# EAGLE design SwitchedPowerAdapter (EAGLE 9.2.1)
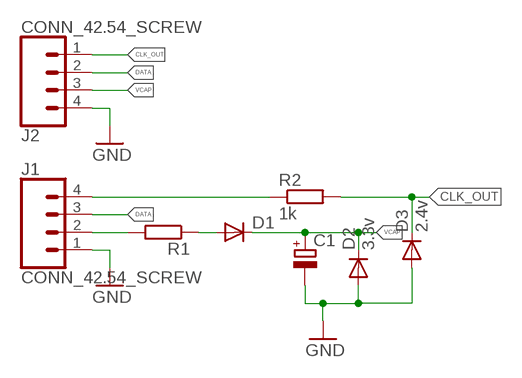
[diagram p0: schematic, sheet 1]

## Parts
C1  CPOL-EUHL  [HL]
D1  DIODEDO-214AC  [DO214AC]
D2  3.3v  DIODESOD-123  [SOD-123]
D3  2.4v  DIODESOD-123  [SOD-123]
J1  CONN_42.54_SCREW  [1X04_SCREW]
J2  CONN_42.54_SCREW  [1X04_SCREW]
R1  R-EU_R2512  [R2512]
R2  1k  R-EU_R0402  [R0402]

## Nets
CLK: J1.4 R2.1
CLK_OUT: D3.CAT(C) J2.1 R2.2
DATA: J1.3 J2.2
GND: C1.- D2.ANODE(A) D3.ANODE(A) J1.1 J2.4
N$1: J1.2 R1.2
N$2: D1.A R1.1
VCAP: C1.+ D1.C D2.CAT(C) J2.3

## Library data of the parts
C1 = bschulz_passives:CPOL-EU: POLARIZED CAPACITOR, European symbol
D1 = bschulz:DIODE: Genaric Diode; DIGIKEY: S1AFSCT-ND; MF: On Semiconductor; MPN: S1A
D2 = bschulz:DIODE: Genaric Diode; DIGIKEY: MMSZ4683-HE3-08GICT-ND; MF: Vishay; MPN: MMSZ4683-HE3-08
D3 = bschulz:DIODE: Genaric Diode
J1 J2 = bschulz:CONN_4: Genaric 4 pin connector; DIGIKEY: ED10563-ND; MF: On Shore; MPN: OSTVN04A150
R1 = bschulz_passives:R-EU_: RESISTOR, European symbol Digikey Parts: Yageo, 0402 <https://www.digikey.com/products/en/resistors/chip-resistor-surface-mount/52?k=&pkeyword=&sf=0&FV=ffec1104%2Cfffc000d%2C1c0002%2C440067%2C1f140000%2Cffe00034%2C400004&quantity=&ColumnSort=0&page=1&stock=1&pageSize=25> Yageo, 0603 <https://www.digikey.com/products/en/resistors/chip-resistor-surface-mount/52?k=&pkeyword=&s=4356&s=47360&sf=0&FV=fffc000d%2C1c0002%2C142c040c%2C1f140000%2Cffe00034&quantity=10&ColumnSort=1000011&page=1&stock=1&pageSize=25> Panasonic, 0603 <https://www.digikey.com/products/en/resistors/chip-resistor-surface-mount/52?k=&pkeyword=&pv252=68&sf=0&FV=ffec373d%2C1c0002%2C142c040c%2C1f140000%2Cffe00034%2C80002%2Cc0001&quantity=&ColumnSort=0&page=1&stock=1&pageSize=25> Panasonic, precision, 0603 <https://www.digikey.com/products/en/resistors/chip-resistor-surface-mount/52?FV=ffec4907%2Cfffc000a%2Cc0172%2C142c040c%2C1f140000%2Cffe00034%2C1c0002&quantity=100&ColumnSort=2085&page=1&stock=1&pageSize=25> Panasonic, 0805 <https://www.digikey.com/products/en/resistors/chip-resistor-surface-mount/52?k=&pkeyword=&pv3=1&sf=0&FV=ffec373d%2C1c0002%2C1f140000%2Cffe00034%2C142c040d&quantity=&ColumnSort=0&page=1&stock=1&pageSize=25> Rohm, current sense <https://www.digikey.com/products/en/resistors/chip-resistor-surface-mount/52?k=&pkeyword=&pv3=1&sf=0&FV=ffecb688%2C1f140000%2Cffe00034%2C1c0002&quantity=&ColumnSort=0&page=1&stock=1&pageSize=25> Vishay, pulse proof automotive <https://www.digikey.com/products/en/resistors/chip-resistor-surface-mount/52?k=&pkeyword=&pv7=2&sf=0&FV=ffec5d6b%2Cffe00034%2C1f140000&quantity=&ColumnSort=0&page=1&stock=1&pageSize=25>
R2 = bschulz_passives:R-EU_: RESISTOR, European symbol Digikey Parts: Yageo, 0402 <https://www.digikey.com/products/en/resistors/chip-resistor-surface-mount/52?k=&pkeyword=&sf=0&FV=ffec1104%2Cfffc000d%2C1c0002%2C440067%2C1f140000%2Cffe00034%2C400004&quantity=&ColumnSort=0&page=1&stock=1&pageSize=25> Yageo, 0603 <https://www.digikey.com/products/en/resistors/chip-resistor-surface-mount/52?k=&pkeyword=&s=4356&s=47360&sf=0&FV=fffc000d%2C1c0002%2C142c040c%2C1f140000%2Cffe00034&quantity=10&ColumnSort=1000011&page=1&stock=1&pageSize=25> Panasonic, 0603 <https://www.digikey.com/products/en/resistors/chip-resistor-surface-mount/52?k=&pkeyword=&pv252=68&sf=0&FV=ffec373d%2C1c0002%2C142c040c%2C1f140000%2Cffe00034%2C80002%2Cc0001&quantity=&ColumnSort=0&page=1&stock=1&pageSize=25> Panasonic, precision, 0603 <https://www.digikey.com/products/en/resistors/chip-resistor-surface-mount/52?FV=ffec4907%2Cfffc000a%2Cc0172%2C142c040c%2C1f140000%2Cffe00034%2C1c0002&quantity=100&ColumnSort=2085&page=1&stock=1&pageSize=25> Panasonic, 0805 <https://www.digikey.com/products/en/resistors/chip-resistor-surface-mount/52?k=&pkeyword=&pv3=1&sf=0&FV=ffec373d%2C1c0002%2C1f140000%2Cffe00034%2C142c040d&quantity=&ColumnSort=0&page=1&stock=1&pageSize=25> Rohm, current sense <https://www.digikey.com/products/en/resistors/chip-resistor-surface-mount/52?k=&pkeyword=&pv3=1&sf=0&FV=ffecb688%2C1f140000%2Cffe00034%2C1c0002&quantity=&ColumnSort=0&page=1&stock=1&pageSize=25> Vishay, pulse proof automotive <https://www.digikey.com/products/en/resistors/chip-resistor-surface-mount/52?k=&pkeyword=&pv7=2&sf=0&FV=ffec5d6b%2Cffe00034%2C1f140000&quantity=&ColumnSort=0&page=1&stock=1&pageSize=25>; MF: Yageo

## Board
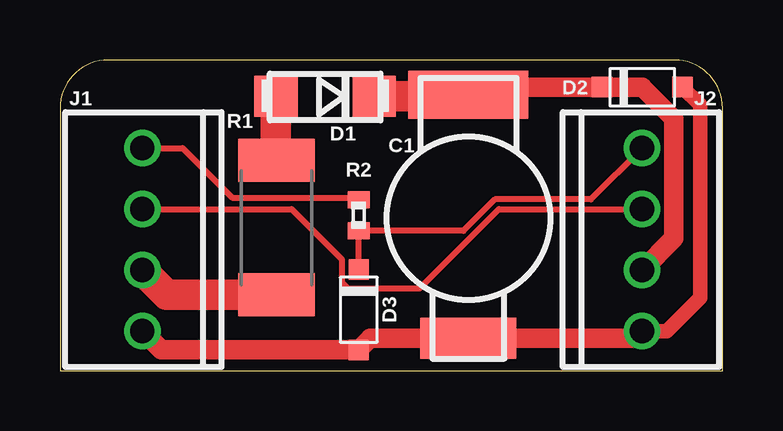
[diagram p1: board, top side]
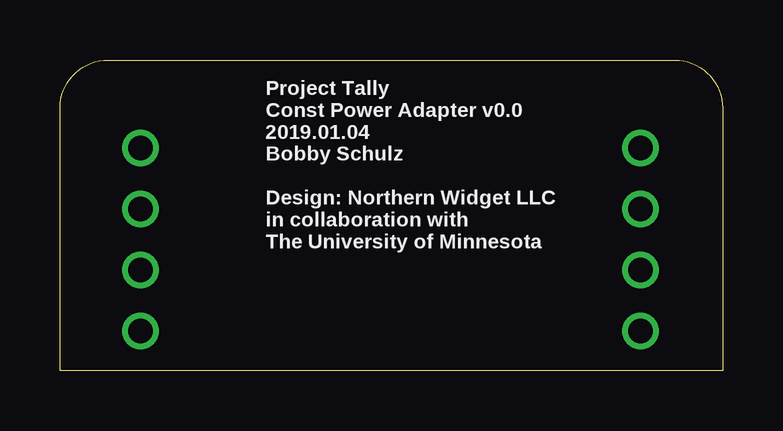
[diagram p2: board, bottom side, seen from below]

Size 27.61 x 12.94 mm. Coordinates in mm from the lower left corner, seen from the top.
Outline: 0,0 27.61,0 27.61,10.94 arc90 25.61,12.94 2,12.94 arc90 0,10.94 0,0
Copper layers (1*16): Top 0.035559375mm / dielectric 1.6mm / Bottom 0.035559375mm
Design rules "oshpark-2layer": minimum track width 6mil, minimum drill 10mil, track to track 6mil, track to pad 6mil, pad to pad 6mil, via to via 6mil, smd to smd 6mil, copper to edge 15mil, drill to drill 6mil, minimum pad ring 5mil, minimum via ring 5mil, stop-mask expansion 2.5mil, vias tented up to drill 0mil, thermal gap 10mil

### Footprints (pad centres in the part's own frame; a part is rotated, then mirrored left to right if it is on the bottom)
HL = smd 5 x 2: + 0,5.15 | smd 4 x 1.7: - 0,-5
DO214AC = smd 1.8 x 1.7: A 2.05,0; C -2.05,0
SOD-123 = smd 0.85 x 0.85: ANODE 1.675,0; CAT -1.675,0
1X04_SCREW = drill 1.016: 1 -3.81,0; 2 -1.27,0; 3 1.27,0; 4 3.81,0
R2512 = smd 1.8 x 3.2: 1 -2.8,0; 2 2.8,0
R0402 = smd 0.7 x 0.9: 1 -0.65,0; 2 0.65,0

### Placement (x,y rotation side)
C1  17.02,6.35 0 top
D1  11.05,11.43 180 top
D2  24.26,11.81 0 top
D3  12.45,2.54 270 top
J1  3.43,5.46 90 top
J2  24.26,5.46 270 top
R1  9.02,5.97 270 top
R2  12.45,6.48 270 top

### Tracks (layer width: path | path; a pad name or v marks a point on that pad's centre or on a via)
CLK
  Top 0.254: J1.4 5.11,9.27 7.17,7.21 12.36,7.21 R2.1
CLK_OUT
  Top 0.254: D3.CAT R2.2 16.81,5.83 18.12,7.14 22.12,7.14 J2.1
DATA
  Top 0.254: J1.3 9.65,6.73 11.74,4.64 11.74,3.67 11.99,3.43 14.99,3.43 18.29,6.73 J2.2
GND
  Top 0.61: 16.53,0.86 C1.- | D2.ANODE 26.67,11.07 26.67,3.05 25.27,1.65 J2.4
  Top 0.813: J1.1 4.21,0.86 D3.ANODE 12.93,1.35 C1.- 23.96,1.35 J2.4
N$1
  Top 1.27: R1.2 4.45,3.17 J1.2
N$2
  Top 1.016: 9,8.79 R1.1
  Top 1.27: D1.A 9,8.79
VCAP
  Top 0.813: C1.+ 17.33,11.81 D2.CAT 24.26,11.81 25.58,10.49 25.58,5.51 J2.3
  Top 1.27: C1.+ 16.95,11.43 D1.C

### Text on the board
bPlace: Project Tally / Const Power Adapter v0.0 / 2019.01.04 / Bobby Schulz / / Design: Northern Widget LLC / in collaboration with / The University of Minnesota
tDocu: Tally Const / Power
bDocu: Clk | Clk | Data | Data | To Logger | To Tally | Vin | VCap | GND | GND